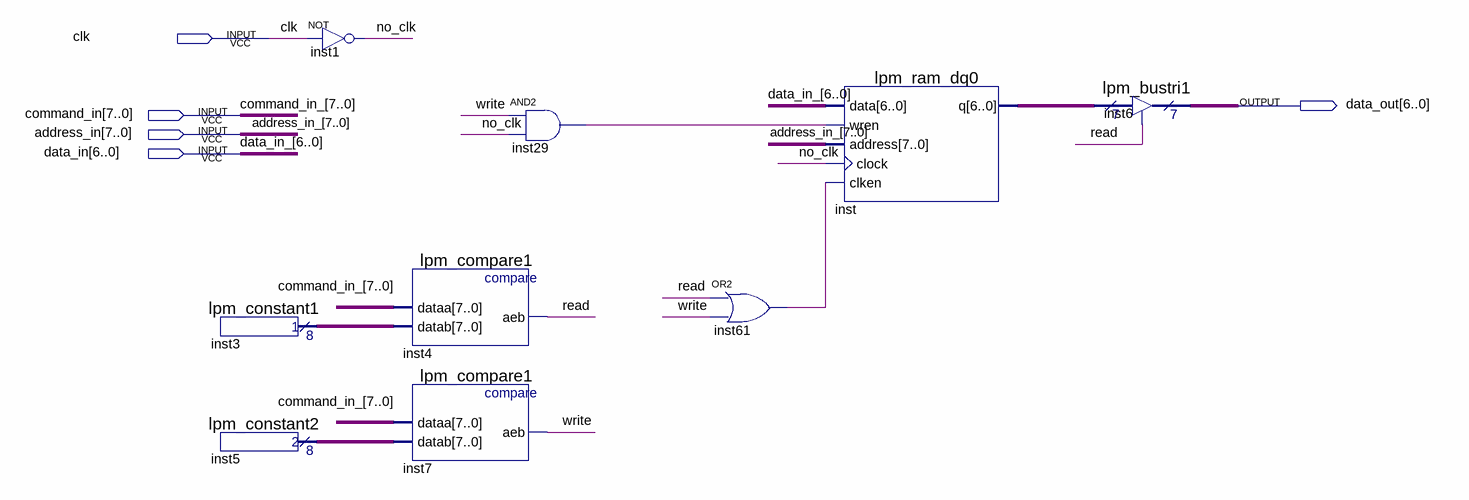
[diagram p0: schematic sheet]
// Quartus schematic RAM.bdf as structural Verilog: 9 symbols, 5 pins
module RAM (
  input  clk,
  input  [7:0] command_in,
  input  [7:0] address_in,
  input  [6:0] data_in,
  output [6:0] data_out
);

  wire inst29_out, inst61_out, no_clk, read, write;
  wire [6:0] inst_q;
  wire [7:0] inst3_result, inst5_result;

  lpm_constant1 inst3 (.result(inst3_result));
  lpm_constant2 inst5 (.result(inst5_result));
  not inst1 (no_clk, clk);
  lpm_compare1 inst4 (.dataa(command_in), .datab(inst3_result), .aeb(read));
  lpm_compare1 inst7 (.dataa(command_in), .datab(inst5_result), .aeb(write));
  and inst29 (inst29_out, write, no_clk);
  or inst61 (inst61_out, read, write);
  lpm_ram_dq0 inst (
    .data(data_in), .wren(inst29_out), .address(address_in), .clock(no_clk), .clken(inst61_out), .q(inst_q));
  lpm_bustri1 inst6 (.enabledt(read), .data(inst_q), .tridata(data_out));

  // Other names for the same wires on the sheet: address_in_[7:0] = address_in; command_in_[7:0] = command_in;
  //   data_in_[6:0] = data_in
endmodule
